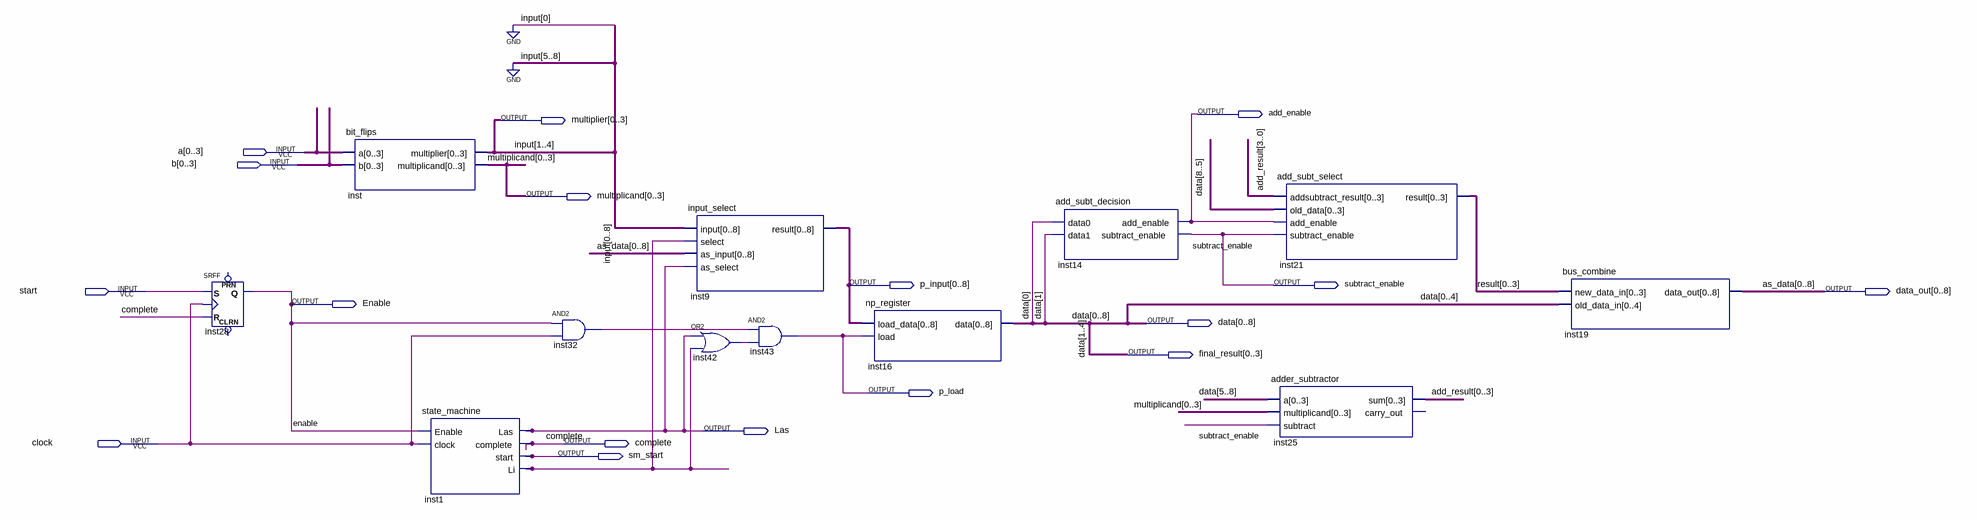
[diagram p0: schematic sheet]
// Quartus schematic multiplier.bdf as structural Verilog: 12 symbols, 17 pins
module multiplier (
  input  [0:3] a,
  input  [0:3] b,
  input  start,
  input  clock,
  output add_enable,
  output [0:3] multiplier,
  output [0:3] multiplicand,
  output [0:8] p_input,
  output subtract_enable,
  output [0:8] data_out,
  output Enable,
  output [0:8] data,
  output [0:3] final_result,
  output p_load,
  output Las,
  output complete,
  output sm_start
);

  wire inst1_li, inst32_out, inst42_out;
  wire [3:0] add_result, result;

  SRFF inst28 (.S(start), .R(complete), .CLK(clock), .Q(Enable));  // open: PRN, CLRN
  bit_flips inst (.a(a), .b(b), .multiplier(multiplier), .multiplicand(multiplicand));
  state_machine inst1 (.Enable(Enable), .clock(clock), .Las(Las), .complete(complete), .start(sm_start), .Li(inst1_li));
  and inst32 (inst32_out, Enable, clock);
  input_select inst9 (
    .\input ({1'b0, multiplier, 4'b0000}), .select(inst1_li), .as_input(data_out), .as_select(Las),
    .result(p_input));
  or inst42 (inst42_out, Las, inst1_li);
  and inst43 (p_load, inst32_out, inst42_out);
  np_register inst16 (.load_data(p_input), .load(p_load), .data(data));
  add_subt_decision inst14 (
    .data0(data[0]), .data1(data[1]), .add_enable(add_enable), .subtract_enable(subtract_enable));
  add_subt_select inst21 (
    .addsubtract_result(add_result), .old_data({data[8], data[7], data[6], data[5]}),
    .add_enable(add_enable), .subtract_enable(subtract_enable),
    .result({result[0], result[1], result[2], result[3]}));
  adder_subtractor inst25 (
    .a(data[5:8]), .multiplicand(multiplicand), .subtract(subtract_enable),
    .sum({add_result[0], add_result[1], add_result[2], add_result[3]}));  // open: carry_out
  bus_combine inst19 (
    .new_data_in({result[0], result[1], result[2], result[3]}), .old_data_in(data[0:4]), .data_out(data_out));

  assign final_result = data[1:4];

  // Other names for the same wires on the sheet: as_data[8:0] = {data_out[8], data_out[7], data_out[6], data_out[5], data_out[4], data_out[3], data_out[2], data_out[1], data_out[0]};
  //   input[4:1] = {multiplier[3], multiplier[2], multiplier[1], multiplier[0]}
endmodule
